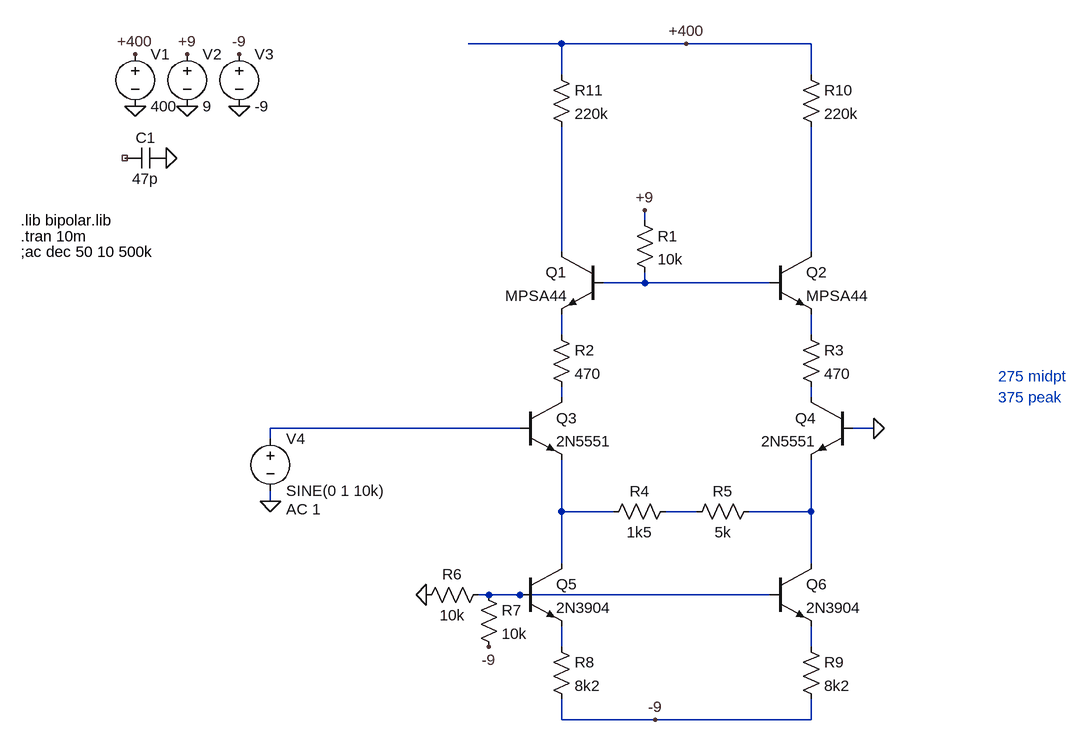
[diagram p0: schematic deflection.asc]
deflection.asc, the LTspice schematic file:
Version 4
SHEET 1 1448 1100
WIRE 560 16 416 16
WIRE 752 16 560 16
WIRE 944 16 752 16
WIRE 560 64 560 16
WIRE 944 64 944 16
WIRE 688 288 688 272
WIRE 560 336 560 144
WIRE 944 336 944 144
WIRE 688 384 688 368
WIRE 688 384 624 384
WIRE 880 384 688 384
WIRE 560 464 560 432
WIRE 944 464 944 432
WIRE 560 560 560 544
WIRE 944 560 944 544
WIRE 496 608 112 608
WIRE 1040 608 1008 608
WIRE 112 624 112 608
WIRE 112 720 112 704
WIRE 560 736 560 656
WIRE 640 736 560 736
WIRE 768 736 720 736
WIRE 944 736 944 656
WIRE 944 736 848 736
WIRE 560 816 560 736
WIRE 944 816 944 736
WIRE 448 864 432 864
WIRE 496 864 448 864
WIRE 880 864 496 864
WIRE 560 944 560 912
WIRE 944 944 944 912
WIRE 560 1056 560 1024
WIRE 704 1056 560 1056
WIRE 944 1056 944 1024
WIRE 944 1056 704 1056
FLAG -96 112 0
FLAG -96 32 +400
FLAG -16 112 0
FLAG -16 32 +9
FLAG 64 112 0
FLAG 64 32 -9
FLAG 688 272 +9
FLAG 448 944 -9
FLAG 352 864 0
FLAG 704 1056 -9
FLAG 752 16 +400
FLAG 112 720 0
FLAG 1040 608 0
FLAG -48 192 0
SYMBOL voltage -96 16 R0
WINDOW 123 0 0 Left 2
WINDOW 39 0 0 Left 2
SYMATTR InstName V1
SYMATTR Value 400
SYMBOL voltage -16 16 R0
WINDOW 123 0 0 Left 2
WINDOW 39 0 0 Left 2
SYMATTR InstName V2
SYMATTR Value 9
SYMBOL voltage 64 16 R0
WINDOW 123 0 0 Left 2
WINDOW 39 0 0 Left 2
SYMATTR InstName V3
SYMATTR Value -9
SYMBOL npn 624 336 M0
SYMATTR InstName Q1
SYMATTR Value MPSA44
SYMBOL npn 880 336 R0
SYMATTR InstName Q2
SYMATTR Value MPSA44
SYMBOL res 672 272 R0
SYMATTR InstName R1
SYMATTR Value 10k
SYMBOL res 544 448 R0
SYMATTR InstName R2
SYMATTR Value 470
SYMBOL res 928 448 R0
SYMATTR InstName R3
SYMATTR Value 470
SYMBOL npn 496 560 R0
SYMATTR InstName Q3
SYMATTR Value 2N5551
SYMBOL npn 1008 560 M0
SYMATTR InstName Q4
SYMATTR Value 2N5551
SYMBOL res 736 720 R90
WINDOW 0 0 56 VBottom 2
WINDOW 3 32 56 VTop 2
SYMATTR InstName R4
SYMATTR Value 1k5
SYMBOL res 864 720 R90
WINDOW 0 0 56 VBottom 2
WINDOW 3 32 56 VTop 2
SYMATTR InstName R5
SYMATTR Value 5k
SYMBOL npn 496 816 R0
SYMATTR InstName Q5
SYMATTR Value 2N3904
SYMBOL npn 880 816 R0
SYMATTR InstName Q6
SYMATTR Value 2N3904
SYMBOL res 448 848 R90
WINDOW 0 0 56 VBottom 2
WINDOW 3 32 56 VTop 2
SYMATTR InstName R6
SYMATTR Value 10k
SYMBOL res 432 848 R0
SYMATTR InstName R7
SYMATTR Value 10k
SYMBOL res 544 928 R0
SYMATTR InstName R8
SYMATTR Value 8k2
SYMBOL res 928 928 R0
SYMATTR InstName R9
SYMATTR Value 8k2
SYMBOL voltage 112 608 R0
WINDOW 123 24 124 Left 2
WINDOW 39 0 0 Left 2
SYMATTR Value2 AC 1
SYMATTR InstName V4
SYMATTR Value SINE(0 1 10k)
SYMBOL cap -48 176 R90
WINDOW 0 0 32 VBottom 2
WINDOW 3 32 32 VTop 2
SYMATTR InstName C1
SYMATTR Value 47p
SYMBOL res 928 48 R0
SYMATTR InstName R10
SYMATTR Value 220k
SYMBOL res 544 48 R0
SYMATTR InstName R11
SYMATTR Value 220k
TEXT -272 288 Left 2 !.lib bipolar.lib
TEXT -272 312 Left 2 !.tran 10m
TEXT 1232 528 Left 2 ;275 midpt
TEXT 1232 560 Left 2 ;375 peak
TEXT -272 336 Left 2 !;ac dec 50 10 500k

The netlist it stands for:
* deflection.asc
V1 +400 0 400
V2 +9 0 9
V3 -9 0 -9
Q1 N001 N003 N004 0 MPSA44
Q2 N002 N003 N005 0 MPSA44
R1 +9 N003 10k
R2 N004 N006 470
R3 N005 N007 470
Q3 N006 N008 N009 0 2N5551
Q4 N007 0 N011 0 2N5551
R4 N010 N009 1k5
R5 N011 N010 5k
Q5 N009 N012 N013 0 2N3904
Q6 N011 N012 N014 0 2N3904
R6 N012 0 10k
R7 N012 -9 10k
R8 N013 -9 8k2
R9 N014 -9 8k2
V4 N008 0 SINE(0 1 10k) AC 1
C1 0 NC_01 47p
R10 +400 N002 220k
R11 +400 N001 220k
.model NPN NPN
.model PNP PNP
.lib standard.bjt
.lib bipolar.lib
.tran 10m
* 275 midpt
* 375 peak
;ac dec 50 10 500k
.backanno
.end